# EAGLE design DCC Read Write Board (EAGLE 9.0.1)

## Sheet 1 of 2
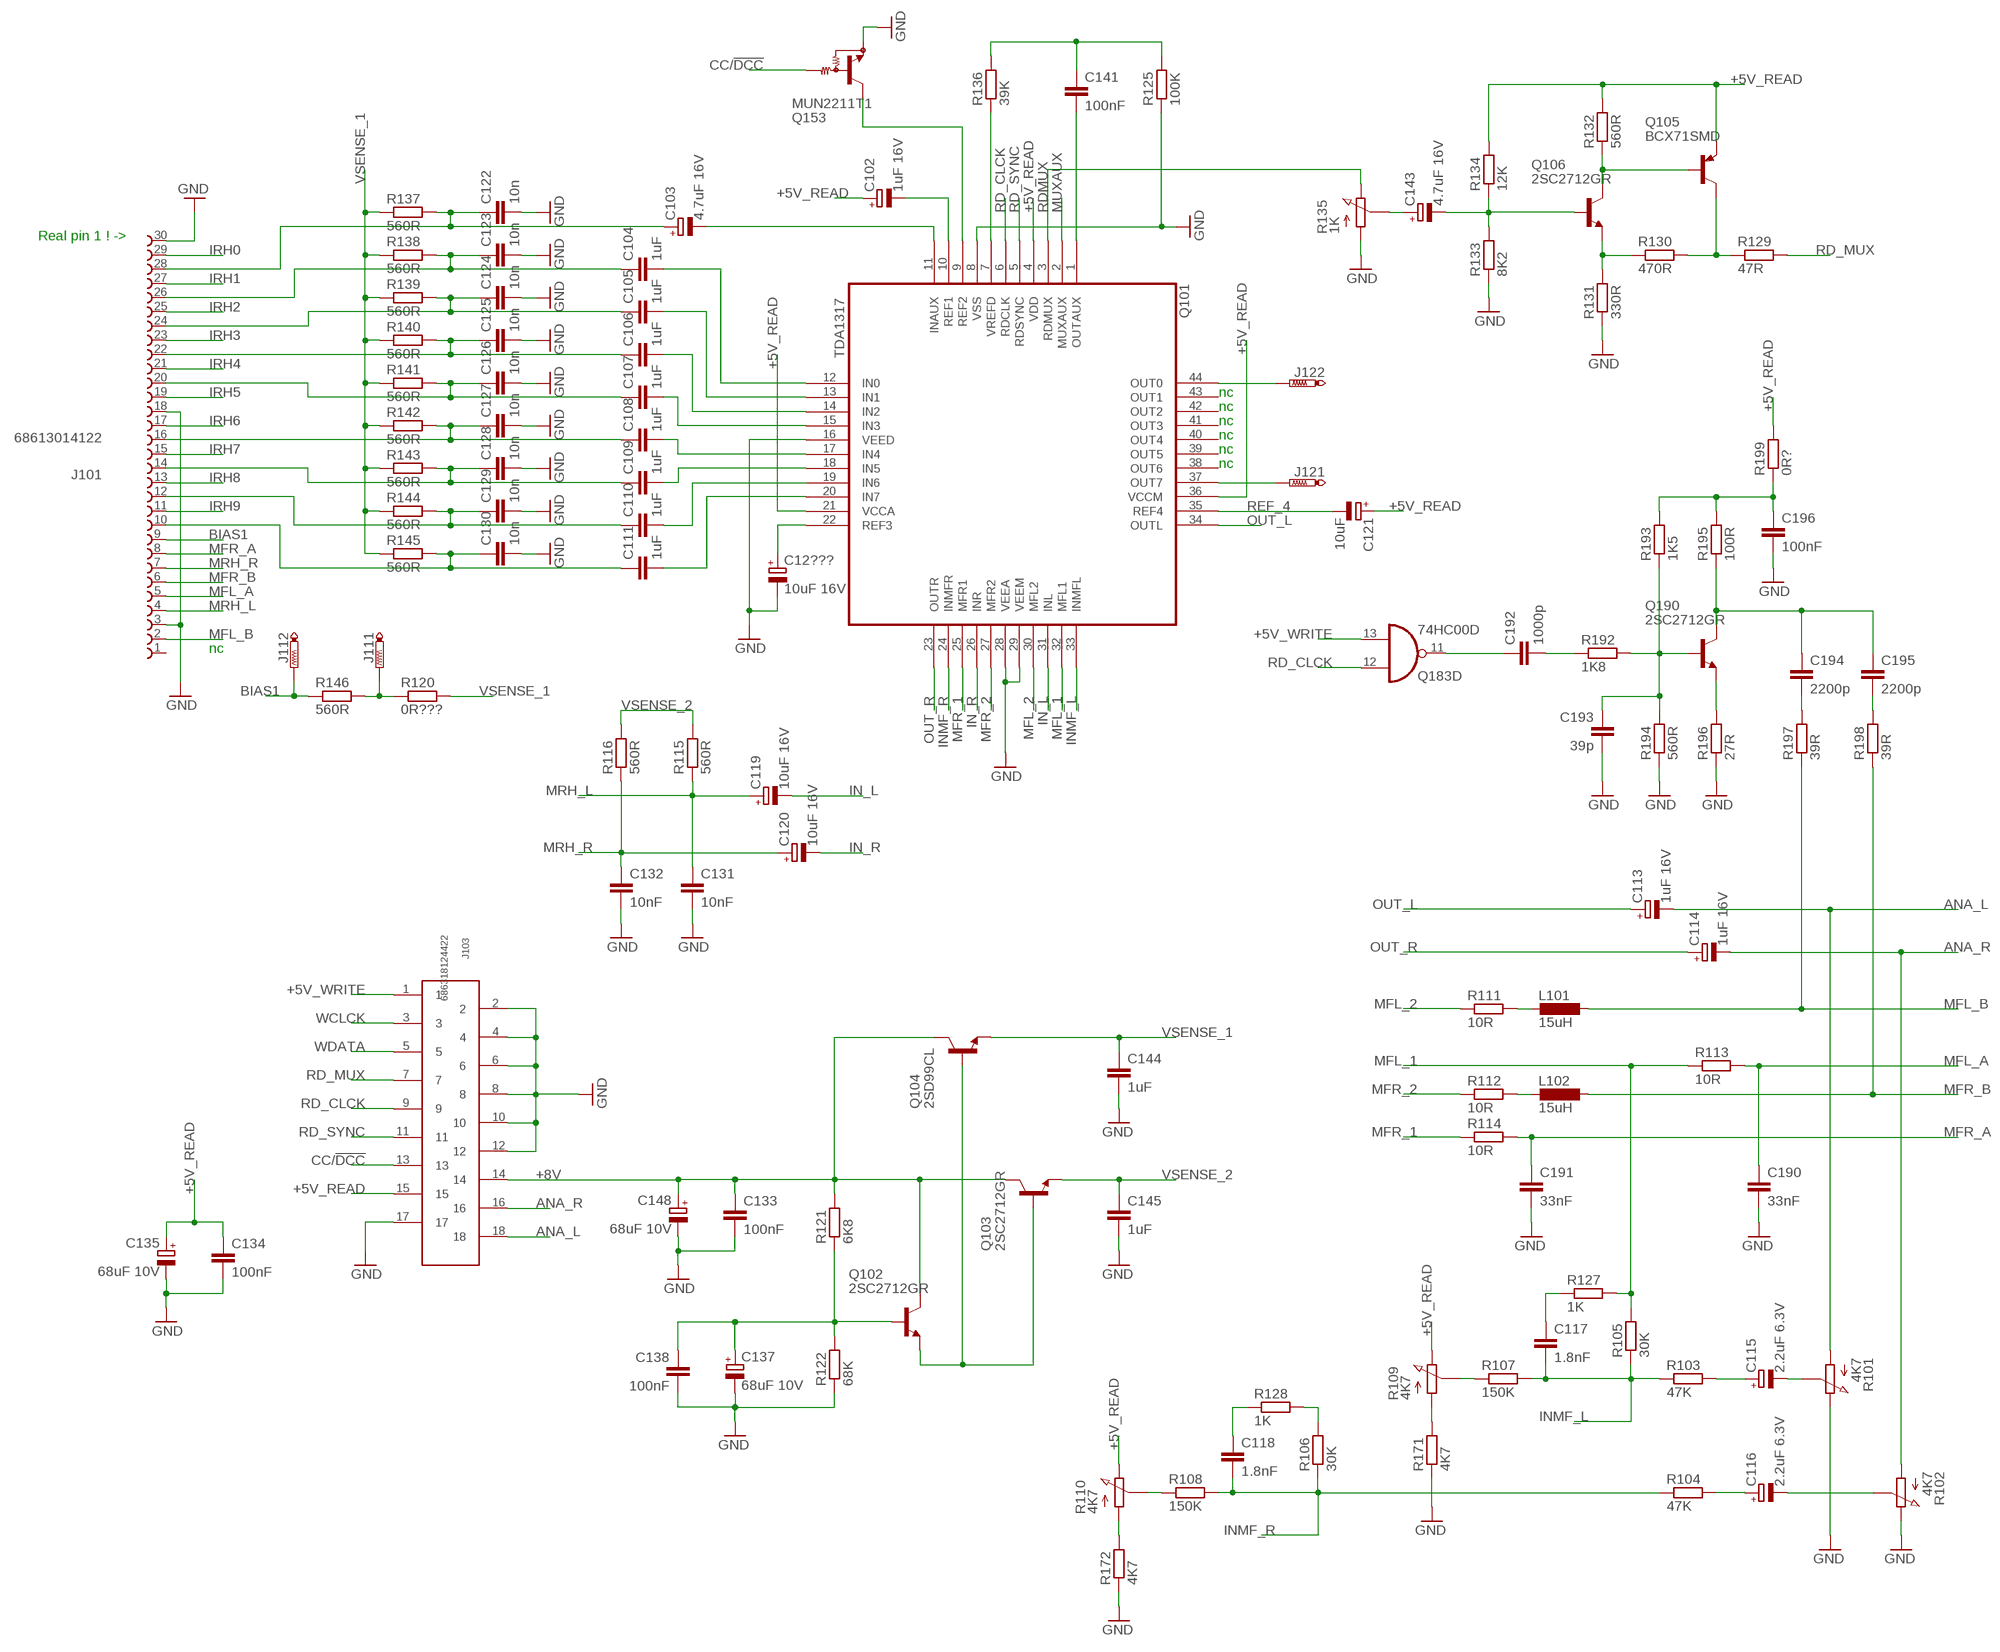
[diagram p0: schematic, sheet 1]

### Parts
C12???  10uF 16V  CPOL-EU153CLV-0505  [153CLV-0505]
C102  1uF 16V  CPOL-EUB/3528-21W  [B/3528-21W]
C103  4.7uF 16V  CPOL-EU153CLV-0505  [153CLV-0505]
C104  1uF  C-EUC0603  [C0603]
C105  1uF  C-EUC0603  [C0603]
C106  1uF  C-EUC0603  [C0603]
C107  1uF  C-EUC0603  [C0603]
C108  1uF  C-EUC0603  [C0603]
C109  1uF  C-EUC0603  [C0603]
C110  1uF  C-EUC0603  [C0603]
C111  1uF  C-EUC0603  [C0603]
C113  1uF 16V  CPOL-EUB/3528-21W  [B/3528-21W]
C114  1uF 16V  CPOL-EUB/3528-21W  [B/3528-21W]
C115  2.2uF 6.3V  CPOL-EUC/6032-28R  [C/6032-28R]
C116  2.2uF 6.3V  CPOL-EUC/6032-28R  [C/6032-28R]
C117  1.8nF  C-EUC0603  [C0603]
C118  1.8nF  C-EUC0603  [C0603]
C119  10uF 16V  CPOL-EU153CLV-0505  [153CLV-0505]
C120  10uF 16V  CPOL-EU153CLV-0505  [153CLV-0505]
C121  10uF  CPOL-EU153CLV-0505  [153CLV-0505]
C122  10n  C-EUC0603  [C0603]
C123  10n  C-EUC0603  [C0603]
C124  10n  C-EUC0603  [C0603]
C125  10n  C-EUC0603  [C0603]
C126  10n  C-EUC0603  [C0603]
C127  10n  C-EUC0603  [C0603]
C128  10n  C-EUC0603  [C0603]
C129  10n  C-EUC0603  [C0603]
C130  10n  C-EUC0603  [C0603]
C131  10nF  C-EUC0603  [C0603]
C132  10nF  C-EUC0603  [C0603]
C133  100nF  C-EUC0603  [C0603]
C134  100nF  C-EUC0603  [C0603]
C135  68uF 10V  CPOL-EUE  [PANASONIC_E]
C137  68uF 10V  CPOL-EUE  [PANASONIC_E]
C138  100nF  C-EUC0603  [C0603]
C141  100nF  C-EUC0603  [C0603]
C143  4.7uF 16V  CPOL-EU153CLV-0505  [153CLV-0505]
C144  1uF  C-EUC0603  [C0603]
C145  1uF  C-EUC0603  [C0603]
C148  68uF 10V  CPOL-EUE  [PANASONIC_E]
C190  33nF  C-EUC0603  [C0603]
C191  33nF  C-EUC0603  [C0603]
C192  1000p  C-EUC0603  [C0603]
C193  39p  C-EUC0603  [C0603]
C194  2200p  C-EUC0603  [C0603]
C195  2200p  C-EUC0603  [C0603]
C196  100nF  C-EUC0603  [C0603]
J101  68613014122  [68613014122]
J103  686318124422  [686318124422]
J111  PTR1TP18SQ  [TP18SQ]
J112  PTR1TP18SQ  [TP18SQ]
J121  PTR1TP18SQ  [TP18SQ]
J122  PTR1TP18SQ  [TP18SQ]
L101  15uH  L-EUL1812  [L1812]
L102  15uH  L-EUL1812  [L1812]
Q101  TDA1317  [QFP44]
Q102  2SC2712GR  BC849SMD  [SOT23-BEC]
Q103  2SC2712GR  BC849SMD  [SOT23-BEC]
Q104  2SD99CL  BC849SMD  [SOT23-BEC]
Q105  BCX71SMD  [SOT23]
Q106  2SC2712GR  BC849SMD  [SOT23-BEC]
Q153  MUN2211T1  [SC59-BEC]
Q183  74HC00D  [SO14]
Q190  2SC2712GR  BC849SMD  [SOT23-BEC]
R101  4K7  PC25  [PC25]
R102  4K7  PC25  [PC25]
R103  47K  R-EU_R0603  [R0603]
R104  47K  R-EU_R0603  [R0603]
R105  30K  R-EU_R0603  [R0603]
R106  30K  R-EU_R0603  [R0603]
R107  150K  R-EU_R0603  [R0603]
R108  150K  R-EU_R0603  [R0603]
R109  4K7  PC25  [PC25]
R110  4K7  PC25  [PC25]
R111  10R  R-EU_R0603  [R0603]
R112  10R  R-EU_R0603  [R0603]
R113  10R  R-EU_R0603  [R0603]
R114  10R  R-EU_R0603  [R0603]
R115  560R  R-EU_R0603  [R0603]
R116  560R  R-EU_R0603  [R0603]
R120  0R???  R-EU_R0603  [R0603]
R121  6K8  R-EU_R0603  [R0603]
R122  68K  R-EU_R0603  [R0603]
R125  100K  R-EU_R0603  [R0603]
R127  1K  R-EU_R0603  [R0603]
R128  1K  R-EU_R0603  [R0603]
R129  47R  R-EU_R0603  [R0603]
R130  470R  R-EU_R0603  [R0603]
R131  330R  R-EU_R0603  [R0603]
R132  560R  R-EU_R0603  [R0603]
R133  8K2  R-EU_R0603  [R0603]
R134  12K  R-EU_R0603  [R0603]
R135  1K  PC25  [PC25]
R136  39K  R-EU_R0603  [R0603]
R137  560R  R-EU_R0603  [R0603]
R138  560R  R-EU_R0603  [R0603]
R139  560R  R-EU_R0603  [R0603]
R140  560R  R-EU_R0603  [R0603]
R141  560R  R-EU_R0603  [R0603]
R142  560R  R-EU_R0603  [R0603]
R143  560R  R-EU_R0603  [R0603]
R144  560R  R-EU_R0603  [R0603]
R145  560R  R-EU_R0603  [R0603]
R146  560R  R-EU_R0603  [R0603]
R171  4K7  R-EU_R0603  [R0603]
R172  4K7  R-EU_R0603  [R0603]
R192  1K8  R-EU_R0603  [R0603]
R193  1K5  R-EU_R0603  [R0603]
R194  560R  R-EU_R0603  [R0603]
R195  100R  R-EU_R0603  [R0603]
R196  27R  R-EU_R0603  [R0603]
R197  39R  R-EU_R0603  [R0603]
R198  39R  R-EU_R0603  [R0603]
R199  0R?  R-EU_R0603  [R0603]

### Nets
+5V_READ: C102.+ C121.+ C134.1 C135.+ J103.15 Q101.4(VDD) Q101.21(VCCA) Q101.36(VCCM) Q105.2(E) R109.E R110.E R132.2 R134.2 R199.2
+5V_WRITE: J103.1 Q183.13(D:I1) ; also sheet 2
+8V: C133.1 C148.+ J103.14 Q102.C Q103.C Q104.C R121.2
ANA_L: C113.- J103.18 R101.A
ANA_R: C114.- J103.16 R102.A
BIAS1: J101.9 J112.TP R146.1
CC/!DCC: J103.13 Q153.B
GND: C12???.- C122.2 C123.2 C124.2 C125.2 C126.2 C127.2 C128.2 C129.2 C130.2 C131.2 C132.2 C133.2 C134.2 C135.- C137.- C138.2 C144.2 C145.2 C148.- C190.2 C191.2 C193.2 C196.2 J101.3 J101.18 J101.30 J103.2 J103.4 J103.6 J103.8 J103.10 J103.12 J103.17 Q101.8(VSS) Q101.16(VEED) Q101.28(VEEA) Q101.29(VEEM) Q153.E R101.E R102.E R122.1 R125.1 R131.1 R133.1 R135.A R171.1 R172.1 R194.1 R196.1 ; also sheet 2
IN_L: C119.- Q101.31(INL)
IN_R: C120.- Q101.26(INR)
INMF_L: C117.2 Q101.33(INMFL) R103.1 R105.1 R107.2
INMF_R: C118.2 Q101.24(INMFR) R104.1 R106.1 R108.2
IRH0: J101.29 ; also sheet 2
IRH1: J101.27 ; also sheet 2
IRH2: J101.25 ; also sheet 2
IRH3: J101.23 ; also sheet 2
IRH4: J101.21 ; also sheet 2
IRH5: J101.19 ; also sheet 2
IRH6: J101.17 ; also sheet 2
IRH7: J101.15 ; also sheet 2
IRH8: J101.13 ; also sheet 2
IRH9: J101.11 ; also sheet 2
MFL_1: Q101.32(MFL1) R105.2 R113.1 R127.2
MFL_2: Q101.30(MFL2) R111.1
MFL_3: R106.2 R128.2
MFL_A: C190.1 J101.5 R113.2
MFL_B: J101.2 L101.1 R197.1
MFR_1: Q101.25(MFR1) R114.1
MFR_2: Q101.27(MFR2) R112.1
MFR_A: C191.1 J101.8 R114.2
MFR_B: J101.6 L102.1 R198.1
MRH_L: C119.+ C131.1 J101.4 R115.1
MRH_R: C120.+ C132.1 J101.7 R116.1
MUXAUX: Q101.2(MUXAUX)
N$1: C111.2 Q101.20(IN7)
N$2: C110.2 Q101.19(IN6)
N$3: C109.2 Q101.18(IN5)
N$4: C108.2 Q101.17(IN4)
N$5: C107.2 Q101.15(IN3)
N$6: C106.2 Q101.14(IN2)
N$7: C105.2 Q101.13(IN1)
N$8: C104.2 Q101.12(IN0)
N$9: C103.- Q101.11(INAUX)
N$19: C111.1 C130.1 J101.10 R145.2
N$20: C110.1 C129.1 J101.12 R144.2
N$21: C109.1 C128.1 J101.14 R143.2
N$22: C108.1 C127.1 J101.16 R142.2
N$23: C107.1 C126.1 J101.20 R141.2
N$24: C106.1 C125.1 J101.22 R140.2
N$25: C105.1 C124.1 J101.24 R139.2
N$26: C104.1 C123.1 J101.26 R138.2
N$27: C103.+ C122.1 J101.28 R137.2
N$44: Q101.9(REF2) Q153.C
N$51: Q102.E Q103.B Q104.B
N$52: C137.+ C138.1 Q102.B R121.1 R122.2
N$53: C102.- Q101.10(REF1)
N$54: C141.2 Q101.1(OUTAUX)
N$55: Q101.7(VREFD) R136.1
N$56: C141.1 R125.2 R136.2
N$57: C12???.+ Q101.22(REF3)
N$58: C192.1 Q183.11(D:O)
N$59: C192.2 R192.1
N$60: C196.1 R193.2 R195.2 R199.1
N$61: C193.1 Q190.B R192.2 R193.1 R194.2
N$62: C194.1 C195.1 Q190.C R195.1
N$63: Q190.E R196.2
N$64: C195.2 R198.2
N$65: C194.2 R197.2
N$66: L102.2 R112.2
N$67: L101.2 R111.2
N$68: J122.TP Q101.44(OUT0)
N$69: J121.TP Q101.37(OUT7)
N$70: J111.TP R120.1 R146.2
N$71: C115.- R101.S
N$72: C116.- R102.S
N$73: C115.+ R103.2
N$74: C116.+ R104.2
N$75: C143.- Q106.B R133.2 R134.1
N$76: C117.1 R127.1
N$77: R107.1 R109.S
N$78: Q106.E R130.1 R131.2
N$79: C118.1 R128.1
N$80: R108.1 R110.S
N$81: R109.A R171.2
N$82: R110.A R172.2
N$83: Q105.1(B) Q106.C R132.1
N$84: Q105.3(C) R129.1 R130.2
N$85: C143.+ R135.S
OUT_L: C113.+ Q101.34(OUTL)
OUT_R: C114.+ Q101.23(OUTR)
RD_CLCK: J103.9 Q101.6(RDCLK) Q183.12(D:I0)
RD_MUX: J103.7 R129.2
RD_SYNC: J103.11 Q101.5(RDSYNC)
RDMUX: Q101.3(RDMUX) R135.E
REF_4: C121.- Q101.35(REF4)
VSENSE_1: C144.1 Q104.E R120.2 R137.1 R138.1 R139.1 R140.1 R141.1 R142.1 R143.1 R144.1 R145.1
VSENSE_2: C145.1 Q103.E R115.2 R116.2
WCLCK: J103.3 ; also sheet 2
WDATA: J103.5 ; also sheet 2
Unconnected: J101.1 Q101.38(OUT6) Q101.39(OUT5) Q101.40(OUT4) Q101.41(OUT3) Q101.42(OUT2) Q101.43(OUT1)

### Notes on the sheet
- Real pin 1 ! ->
- nc
- nc
- nc
- nc
- nc
- nc
- nc

## Sheet 2 of 2
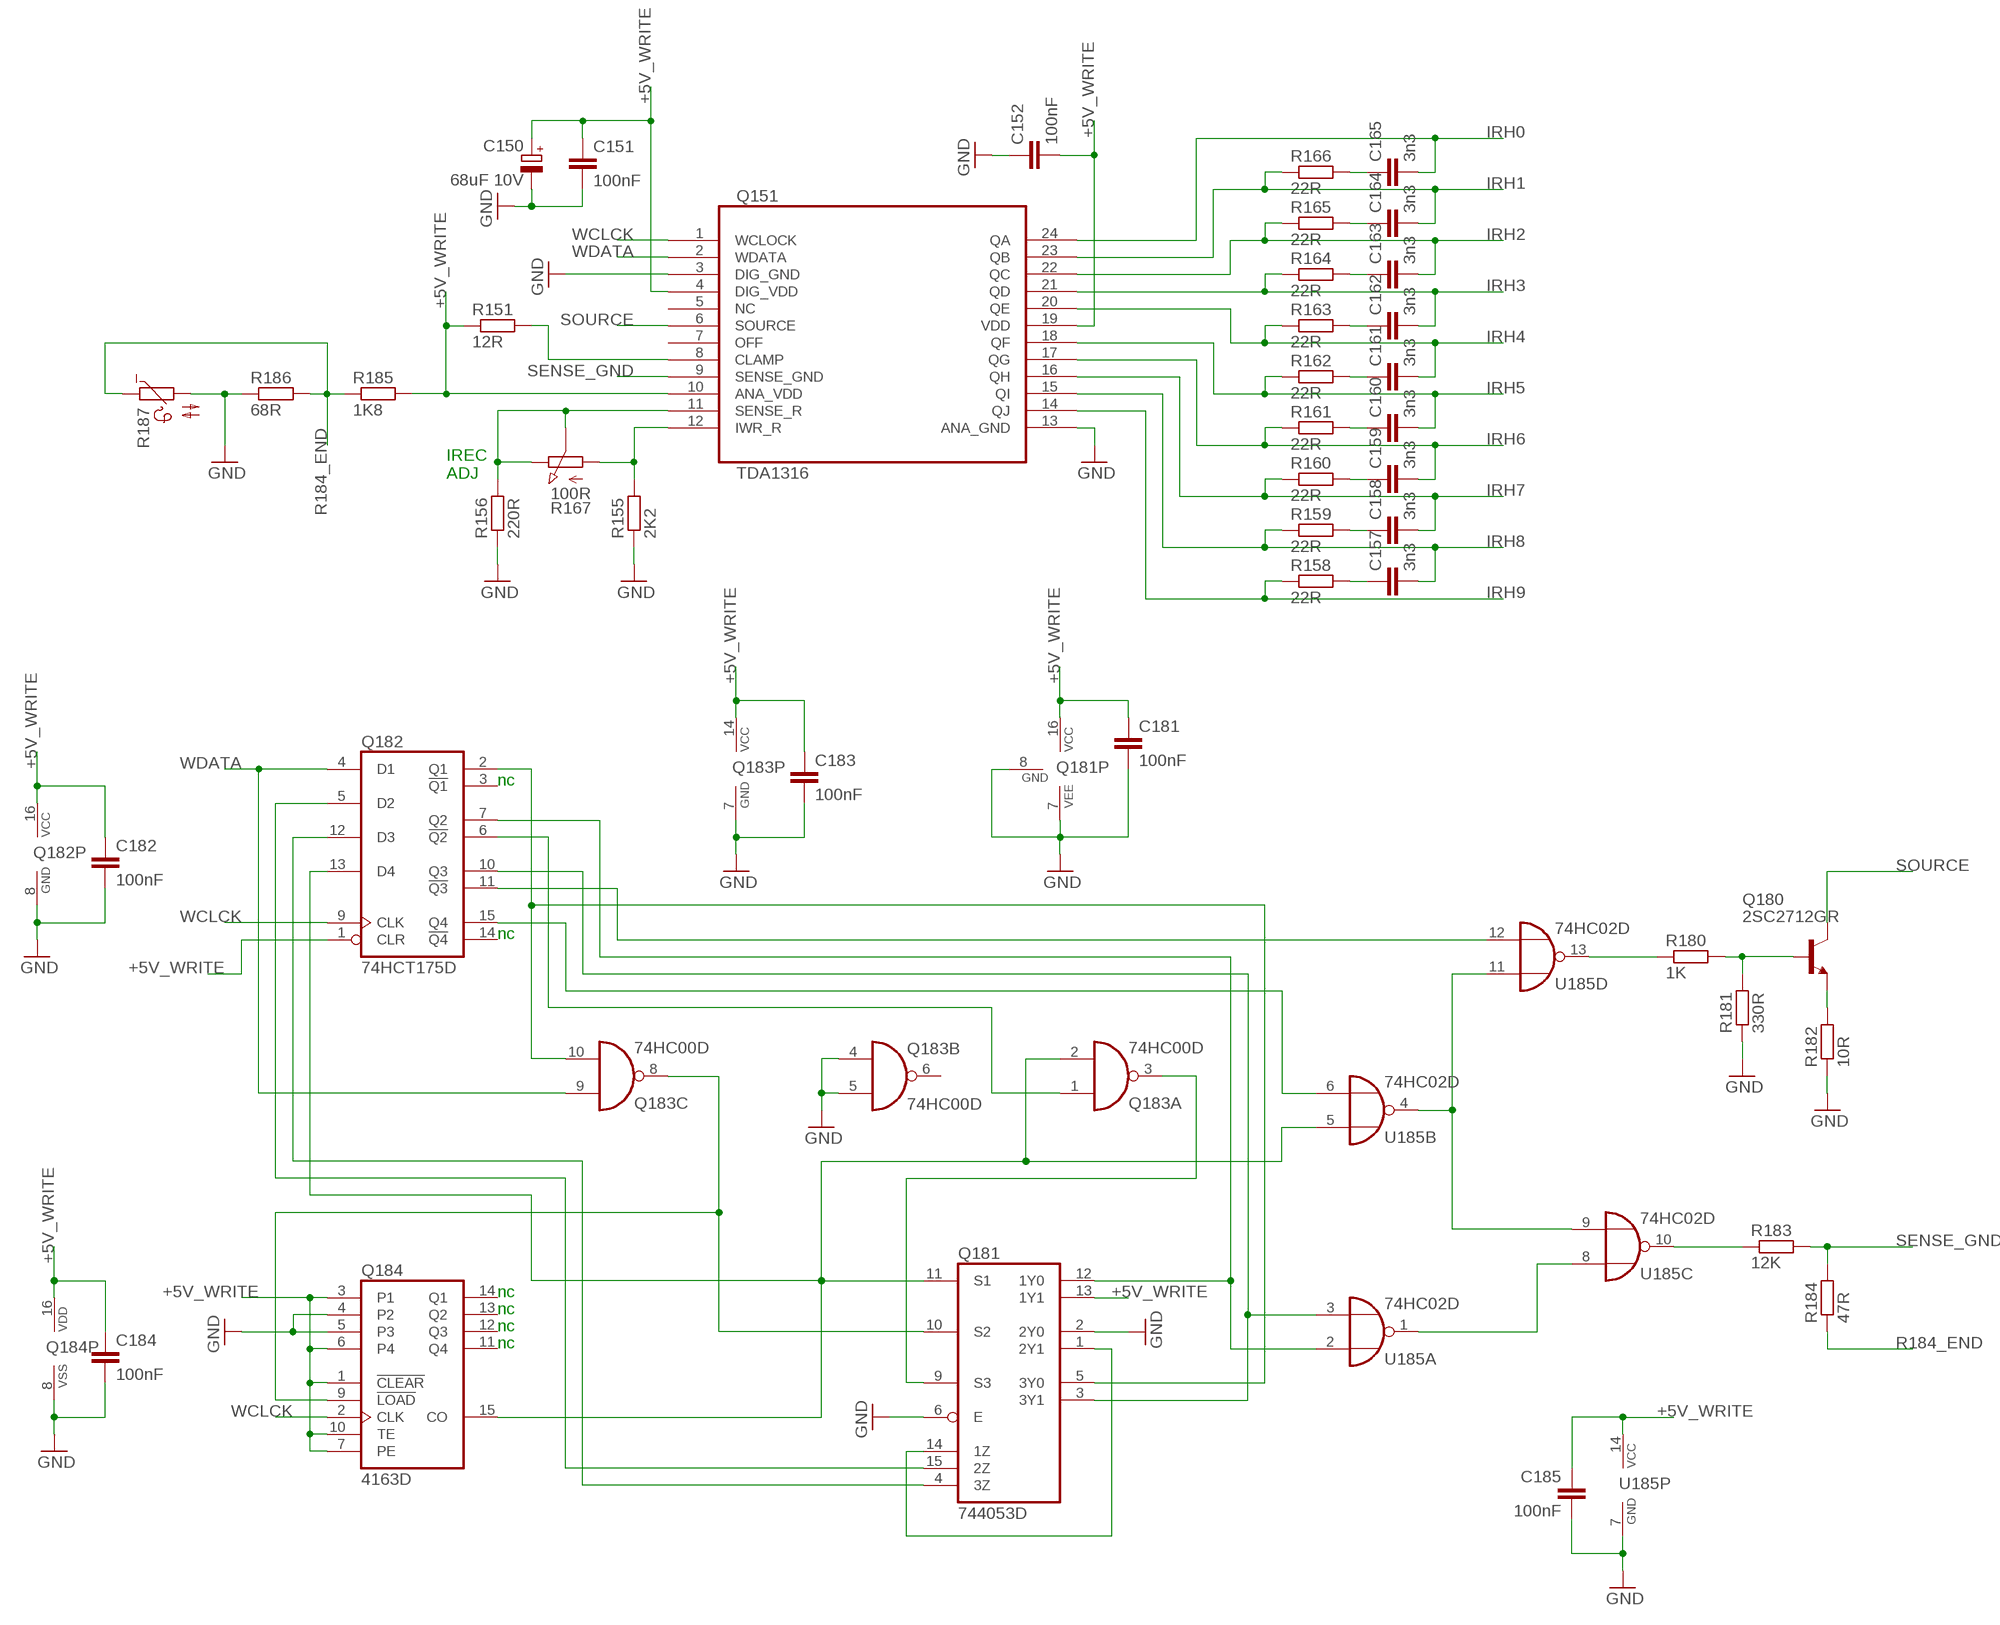
[diagram p1: schematic, sheet 2]

### Parts
C150  68uF 10V  CPOL-EUE  [PANASONIC_E]
C151  100nF  C-EUC0603  [C0603]
C152  100nF  C-EUC0603  [C0603]
C157  3n3  C-EUC0603  [C0603]
C158  3n3  C-EUC0603  [C0603]
C159  3n3  C-EUC0603  [C0603]
C160  3n3  C-EUC0603  [C0603]
C161  3n3  C-EUC0603  [C0603]
C162  3n3  C-EUC0603  [C0603]
C163  3n3  C-EUC0603  [C0603]
C164  3n3  C-EUC0603  [C0603]
C165  3n3  C-EUC0603  [C0603]
C181  100nF  C-EUC0603  [C0603]
C182  100nF  C-EUC0603  [C0603]
C183  100nF  C-EUC0603  [C0603]
C184  100nF  C-EUC0603  [C0603]
C185  100nF  C-EUC0603  [C0603]
Q151  TDA1316  [SO24L]
Q180  2SC2712GR  BC849SMD  [SOT23-BEC]
Q181  744053D  [SO16]
Q182  74HCT175D  [SO16]
Q184  4163D  [SO16]
R151  12R  R-EU_R0603  [R0603]
R155  2K2  R-EU_R0603  [R0603]
R156  220R  R-EU_R0603  [R0603]
R158  22R  R-EU_R0603  [R0603]
R159  22R  R-EU_R0603  [R0603]
R160  22R  R-EU_R0603  [R0603]
R161  22R  R-EU_R0603  [R0603]
R162  22R  R-EU_R0603  [R0603]
R163  22R  R-EU_R0603  [R0603]
R164  22R  R-EU_R0603  [R0603]
R165  22R  R-EU_R0603  [R0603]
R166  22R  R-EU_R0603  [R0603]
R167  100R  PC25  [PC25]
R180  1K  R-EU_R0603  [R0603]
R181  330R  R-EU_R0603  [R0603]
R182  10R  R-EU_R0603  [R0603]
R183  12K  R-EU_R0603  [R0603]
R184  47R  R-EU_R0603  [R0603]
R185  1K8  R-EU_R0603  [R0603]
R186  68R  R-EU_R0603  [R0603]
R187  B57164  [B57164]
U185  74HC02D  [SO14]

### Nets
+5V_WRITE: C150.+ C151.1 C152.2 C181.1 C182.1 C183.1 C184.1 C185.1 Q151.4(DIG_VDD) Q151.10(ANA_VDD) Q151.19(VDD) Q181.13(1Y1) Q181.16(VCC) Q182.1(CLR) Q182.16(VCC) Q183.14(P:VCC) Q184.1(!CLEAR) Q184.3(P1) Q184.6(P4) Q184.7(PE) Q184.10(TE) Q184.16(VDD) R151.1 R185.2 U185.14(P:VCC) ; also sheet 1
GND: C150.- C151.2 C152.1 C181.2 C182.2 C183.2 C184.2 C185.2 Q151.3(DIG_GND) Q151.13(ANA_GND) Q181.2(2Y0) Q181.6(E) Q181.7(VEE) Q181.8(GND) Q182.8(GND) Q183.4(B:I0) Q183.5(B:I1) Q183.7(P:GND) Q184.4(P2) Q184.5(P3) Q184.8(VSS) R155.1 R156.1 R181.1 R182.1 R186.1 R187.2 U185.7(P:GND) ; also sheet 1
IRH0: C165.2 Q151.24(QA) ; also sheet 1
IRH1: C164.2 Q151.23(QB) R166.1 ; also sheet 1
IRH2: C163.2 Q151.22(QC) R165.1 ; also sheet 1
IRH3: C162.2 Q151.21(QD) R164.1 ; also sheet 1
IRH4: C161.2 Q151.20(QE) R163.1 ; also sheet 1
IRH5: C160.2 Q151.18(QF) R162.1 ; also sheet 1
IRH6: C159.2 Q151.17(QG) R161.1 ; also sheet 1
IRH7: C158.2 Q151.16(QH) R160.1 ; also sheet 1
IRH8: C157.2 Q151.15(QI) R159.1 ; also sheet 1
IRH9: Q151.14(QJ) R158.1 ; also sheet 1
N$11: Q181.10(S2) Q183.8(C:O) Q184.9(!LOAD)
N$12: Q181.5(3Y0) Q182.2(Q1) Q183.10(C:I1)
N$13: Q181.11(S1) Q182.13(D4) Q183.2(A:I1) Q184.15(CO) U185.5(B:I0)
N$14: Q181.15(2Z) Q182.5(D2)
N$15: Q181.9(S3) Q183.3(A:O)
N$16: Q182.6(!Q2) Q183.1(A:I0)
N$17: Q182.15(Q4) U185.6(B:I1)
N$18: U185.4(B:O) U185.9(C:I1) U185.11(D:I0)
N$28: Q181.3(3Y1) Q182.10(Q3) U185.3(A:I1)
N$29: Q181.1(2Y1) Q181.14(1Z)
N$30: C165.1 R166.2
N$31: C164.1 R165.2
N$32: C163.1 R164.2
N$33: C162.1 R163.2
N$34: C161.1 R162.2
N$35: C160.1 R161.2
N$36: C159.1 R160.2
N$37: C158.1 R159.2
N$38: C157.1 R158.2
N$39: Q181.12(1Y0) Q182.7(Q2) U185.2(A:I0)
N$40: U185.1(A:O) U185.8(C:I0)
N$41: Q182.11(!Q3) U185.12(D:I1)
N$42: Q181.4(3Z) Q182.12(D3)
N$43: R183.1 U185.10(C:O)
N$45: R180.1 U185.13(D:O)
N$46: Q180.B R180.2 R181.2
N$47: Q180.E R182.2
N$48: Q151.11(SENSE_R) R156.2 R167.E R167.S
N$49: Q151.12(IWR_R) R155.2 R167.A
N$50: Q151.8(CLAMP) R151.2
R184_END: R184.1 R185.1 R186.2 R187.1
SENSE_GND: Q151.9(SENSE_GND) R183.2 R184.2
SOURCE: Q151.6(SOURCE) Q180.C
WCLCK: Q151.1(WCLOCK) Q182.9(CLK) Q184.2(CLK) ; also sheet 1
WDATA: Q151.2(WDATA) Q182.4(D1) Q183.9(C:I0) ; also sheet 1
Unconnected: Q151.5(NC) Q151.7(OFF) Q182.3(!Q1) Q182.14(!Q4) Q183.6(B:O) Q184.11(Q4) Q184.12(Q3) Q184.13(Q2) Q184.14(Q1)

### Notes on the sheet
- IREC
  ADJ
- nc
- nc
- nc
- nc
- nc
- nc

## Library data of the parts
C12??? C102 C103 C113-C116 C119-C121 C135 C137 C143 C148 C150 = rcl:CPOL-EU: POLARIZED CAPACITOR, European symbol; SPICEPREFIX: C
C104-C111 C117 C118 C122-C134 C138 C141 C144 C145 C151 C152 C157-C165 C181-C185 C190-C196 = rcl:C-EU: CAPACITOR, European symbol; SPICEPREFIX: C
J101 = FPC_Connectors_Flat_Flexible_Cable_rev15c:68613014122: WR-FPC 1.00mm SMT ZIF Horizontal Top Contact, 30 Pins=>Code : Con_FPC_ZIF_1.00_68613014122 <http://katalog.we-online.de/media/images/eican/Con_FPC_ZIF_1.00_6861xx14122_pf2.jpg> Details see: http://katalog.we-online.de/en/em/686_1xx_141_22 Created 2014-07-09, Karrer Zheng 2014 (C) Würth Elektronik
J103 = FPC_Connectors_Flat_Flexible_Cable_rev15c:686318124422: WR-FPC-1.00mm SMT ZIF Vertical Type A,18 pins=>Code : Con_FPC_ZIF_1.00_686318124422 <http://katalog.we-online.de/media/images/eican/Con_FPC_ZIF_1.00_6863xx124422_pf2.jpg> Details see: http://katalog.we-online.de/en/em/686_3xx_124_422 Created 2014-07-09, Karrer Zheng 2014 (C) Würth Elektronik
J111 J112 J121 J122 = testpad:PTR1: TEST PIN
L101 L102 = rcl:L-EU: INDUCTOR, European symbol; SPICEPREFIX: L
Q101 = dcc:TDA1317
Q102-Q104 Q106 Q180 Q190 = transistor-npn:BC849*: NPN Transistor
Q105 = transistor-pnp:BCX71SMD: PNP Transistor
Q151 = dcc:TDA1316
Q153 = transistor-npn:MUN2211*: NPN Bias Resistor Transistor
Q181 = 74xx-eu:74*4053: Triple 2-channel analog multiplexer/demultiplexer Philips Semiconductor
Q182 = 74xx-eu:74*175: Qadruple D type FLIP FLOP, clear
Q183 = 74xx-eu:74*00: Quad 2-input NAND gate
Q184 = 40xx:4163: Synchronous presettable 4-bit binary COUNTER
R101 R102 R109 R110 R135 R167 = pot-vitrohm:PC25: VITROHM POTENTIOMETER; MF: CLAROSTAT; MPN: 308NPC25KS; OC_FARNELL: 1440998; OC_NEWARK: 03F7518
R103-R108 R111-R116 R120-R122 R125 R127-R134 R136-R146 R151 R155 R156 R158-R166 R171 R172 R180-R186 R192-R199 = rcl:R-EU_: RESISTOR, European symbol; SPICEPREFIX: R
R187 = ptc-ntc:B57164: SIEMENS NTC; MPN: B57164K474K52; OC_FARNELL: 9753451; OC_NEWARK: 29M3118
U185 = 74xx-eu:74*02: Quad 2-input NOR gate

## Board
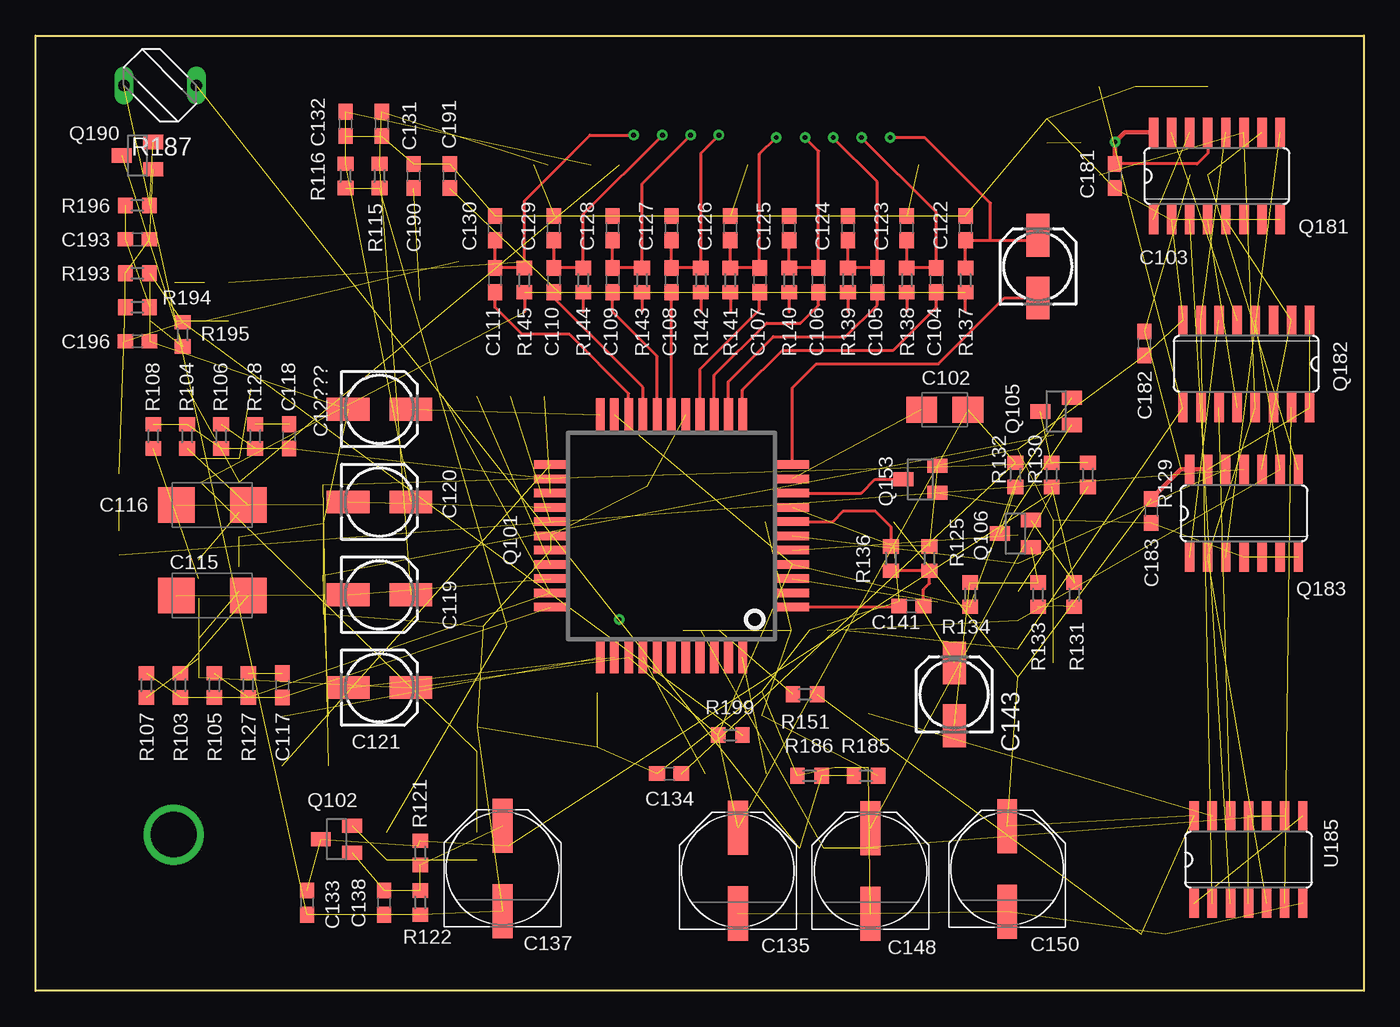
[diagram p2: board, top side]
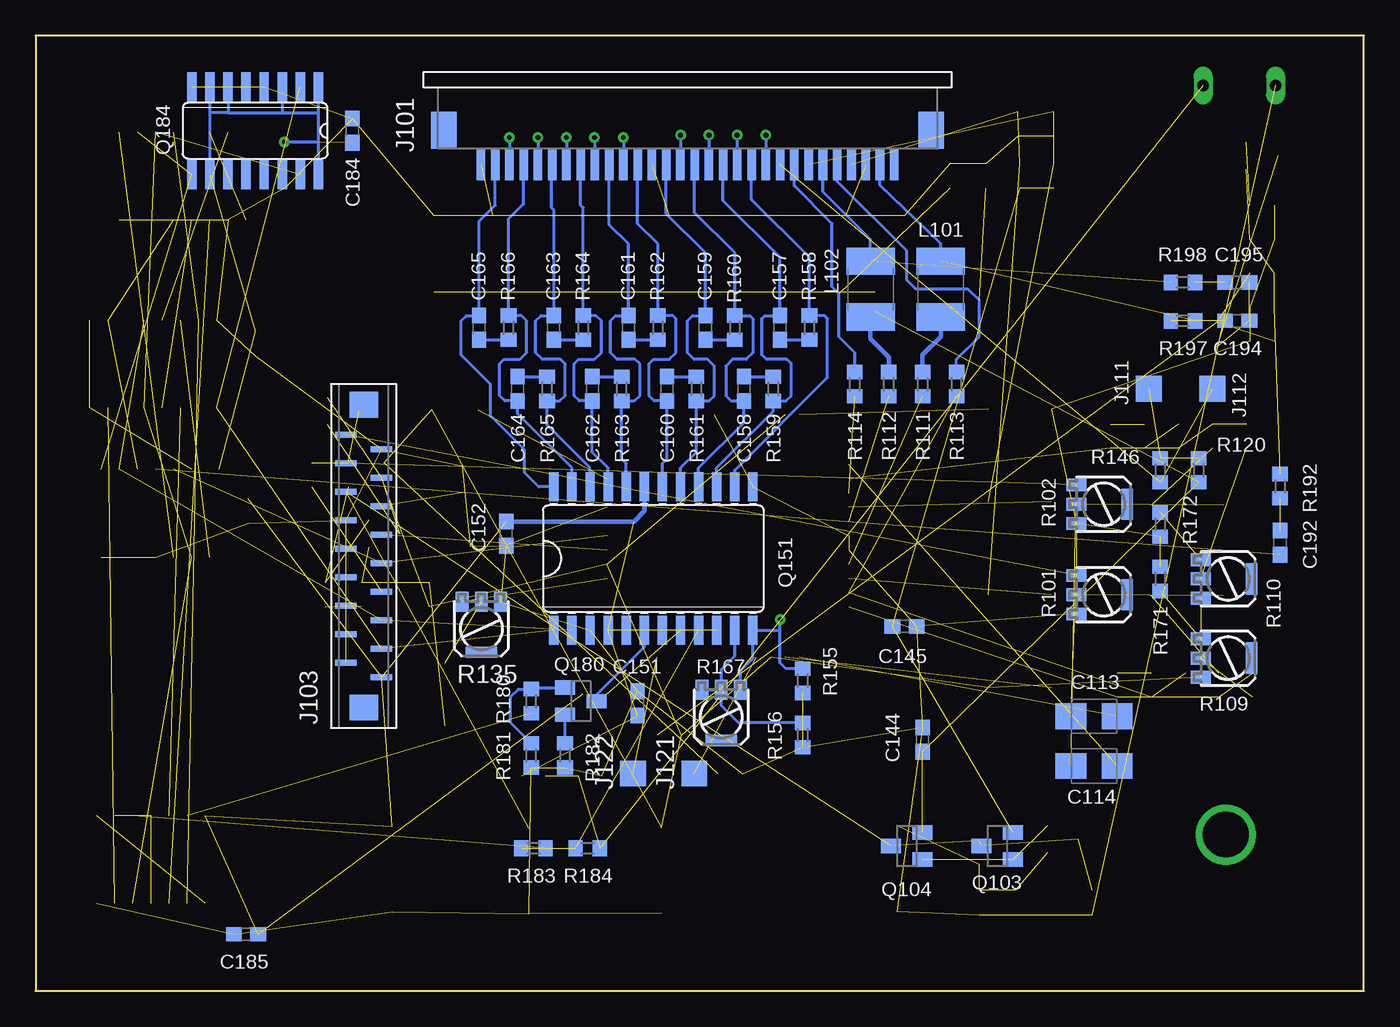
[diagram p3: board, bottom side, seen from below]

Size 93.19 x 66.99 mm. Coordinates in mm from the lower left corner, seen from the top.
Outline: 0,0 0,66.99 93.19,66.99 93.19,0 0,0
Copper layers (1*16): Top 0.035mm / dielectric 1.5mm / Bottom 0.035mm
Design rules "default *": minimum track width 6mil, minimum drill 13mil, track to track 6mil, track to pad 6mil, pad to pad 6mil, via to via 6mil, smd to smd 6mil, copper to edge 40mil, drill to drill 6mil, minimum pad ring 10mil, minimum via ring 8mil, stop-mask expansion 4mil, vias tented up to drill 0mil, thermal gap 10mil

### Footprints (pad centres in the part's own frame; a part is rotated, then mirrored left to right if it is on the bottom)
153CLV-0505 = smd 3 x 1.6: + 2.2,0; - -2.2,0
B/3528-21W = smd 2.15 x 1.8: + 1.625,0; - -1.625,0
C0603 = smd 1.1 x 1: 1 -0.85,0; 2 0.85,0
C/6032-28R = smd 2.55 x 2.5: + 2.525,0; - -2.525,0
PANASONIC_E = smd 3.8 x 1.4: + 3,0; - -3,0
68613014122 = smd 0.6 x 2.2: 1 -14.04,1.1; 2 -13.04,1.1; 3 -12.04,1.1; 4 -11.04,1.1; 5 -10.04,1.1; 6 -9.04,1.1; 7 -8.04,1.1; 8 -7.04,1.1; 9 -6.04,1.1; 10 -5.04,1.1; 11 -4.04,1.1; 12 -3.04,1.1; 13 -2.04,1.1; 14 -1.04,1.1; 15 -0.04,1.1; 16 0.96,1.1; 17 1.96,1.1; 18 2.96,1.1; 19 3.96,1.1; 20 4.96,1.1; 21 5.96,1.1; 22 6.96,1.1; 23 7.96,1.1; 24 8.96,1.1; 25 9.96,1.1; 26 10.96,1.1; 27 11.96,1.1; 28 12.96,1.1; 29 13.96,1.1; 30 14.96,1.1 | smd 1.8 x 2.6: Z1 -16.64,-1.3; Z2 17.56,-1.3
686318124422 = smd 0.42 x 1.5: 1 -7.85,-1.25; 2 -6.85,1.25; 3 -5.85,-1.25; 4 -4.85,1.25; 5 -3.85,-1.25; 6 -2.85,1.25; 7 -1.85,-1.25; 8 -0.85,1.25; 9 0.15,-1.25; 10 1.15,1.25; 11 2.15,-1.25; 12 3.15,1.25; 13 4.15,-1.25; 14 5.15,1.25; 15 6.15,-1.25; 16 7.15,1.25; 17 8.15,-1.25; 18 9.15,1.25 | smd 1.8 x 2: Z1 -9.96,0; Z2 11.26,0
TP18SQ = smd 1.8 x 1.8: TP 0,0
L1812 = smd 1.9 x 3.4: 1 -1.95,0; 2 1.95,0
QFP44 = smd 0.6 x 2.3: 1 -5,-8.5; 2 -4,-8.5; 3 -3,-8.5; 4 -2,-8.5; 5 -1,-8.5; 6 0,-8.5; 7 1,-8.5; 8 2,-8.5; 9 3,-8.5; 10 4,-8.5; 11 5,-8.5; 23 5,8.5; 24 4,8.5; 25 3,8.5; 26 2,8.5; 27 1,8.5; 28 0,8.5; 29 -1,8.5; 30 -2,8.5; 31 -3,8.5; 32 -4,8.5; 33 -5,8.5 | smd 2.3 x 0.6: 12 8.5,-5; 13 8.5,-4; 14 8.5,-3; 15 8.5,-2; 16 8.5,-1; 17 8.5,0; 18 8.5,1; 19 8.5,2; 20 8.5,3; 21 8.5,4; 22 8.5,5; 34 -8.5,5; 35 -8.5,4; 36 -8.5,3; 37 -8.5,2; 38 -8.5,1; 39 -8.5,0; 40 -8.5,-1; 41 -8.5,-2; 42 -8.5,-3; 43 -8.5,-4; 44 -8.5,-5
SOT23-BEC = smd 1 x 1.4: B -0.95,-1.1; C 0,1.1; E 0.95,-1.1
SOT23 = smd 1 x 1.4: 1 -0.95,-1.1; 2 0.95,-1.1; 3 0,1.1
SO24L = smd 0.66 x 2.032: 1 -8.255,-5.029; 2 -6.985,-5.029; 3 -5.715,-5.029; 4 -4.445,-5.029; 5 -3.175,-5.029; 6 -1.905,-5.029; 7 -0.635,-5.029; 8 0.635,-5.029; 9 1.905,-5.029; 10 3.175,-5.029; 11 4.445,-5.029; 12 5.715,-5.029; 13 5.715,5.029; 14 4.445,5.029; 15 3.175,5.029; 16 1.905,5.029; 17 0.635,5.029; 18 -0.635,5.029; 19 -1.905,5.029; 20 -3.175,5.029; 21 -4.445,5.029; 22 -5.715,5.029; 23 -6.985,5.029; 24 -8.255,5.029
SC59-BEC = smd 1 x 1.4: B -0.95,-1.2; C 0,1.2; E 0.95,-1.2
SO16 = smd 0.66 x 2.032: 1 -4.445,-3.073; 2 -3.175,-3.073; 3 -1.905,-3.073; 4 -0.635,-3.073; 5 0.635,-3.073; 6 1.905,-3.073; 7 3.175,-3.073; 8 4.445,-3.073; 9 4.445,3.073; 10 3.175,3.073; 11 1.905,3.073; 12 0.635,3.073; 13 -0.635,3.073; 14 -1.905,3.073; 15 -3.175,3.073; 16 -4.445,3.073
SO14 = smd 0.66 x 2.032: 1 -3.81,-3.073; 2 -2.54,-3.073; 3 -1.27,-3.073; 4 0,-3.073; 5 1.27,-3.073; 6 2.54,-3.073; 7 3.81,-3.073; 8 3.81,3.073; 9 2.54,3.073; 10 1.27,3.073; 11 0,3.073; 12 -1.27,3.073; 13 -2.54,3.073; 14 -3.81,3.073
PC25 = smd 2.2 x 0.8: 4 0,1.65 | smd 0.9 x 1.4: A -1.35,-1.9; E 1.35,-1.9; S 0,-1.9
R0603 = smd 1 x 1.1: 1 -0.85,0; 2 0.85,0
B57164 = drill 0.813 long: 1 -2.54,0; 2 2.54,0

### Placement (x,y rotation side)
C12???  24.13,40.8 0 top
C102  63.78,40.76 0 top
C103  70.33,50.8 90 top
C104  63.18,49.85 270 top
C105  59.05,49.85 270 top
C106  54.93,49.85 270 top
C107  50.8,49.85 270 top
C108  44.61,49.85 270 top
C109  40.48,49.85 270 top
C110  36.35,49.85 270 top
C111  32.23,49.85 270 top
C113  18.93,19.27 0 bottom
C114  18.93,15.77 0 bottom
C115  12.4,27.73 0 top
C116  12.4,34.08 0 top
C117  17.3,21.43 270 top
C118  17.78,38.89 270 top
C119  24.13,27.78 0 top
C120  24.13,34.29 0 top
C121  24.13,21.27 0 top
C122  65.25,53.5 90 top
C123  61.12,53.5 90 top
C124  56.99,53.5 90 top
C125  52.86,53.5 90 top
C126  48.74,53.5 90 top
C127  44.61,53.5 90 top
C128  40.48,53.5 90 top
C129  36.35,53.5 90 top
C130  32.23,53.5 90 top
C131  24.29,60.8 270 top
C132  21.75,60.8 270 top
C133  19.05,6.19 270 top
C134  44.45,15.24 180 top
C135  49.27,8.43 90 top
C137  32.76,8.59 90 top
C138  24.45,6.19 270 top
C141  61.44,26.99 180 top
C143  64.45,20.8 90 top
C144  30.96,17.62 90 bottom
C145  32.23,25.56 0 bottom
C148  58.58,8.41 90 top
C150  68.16,8.55 90 top
C151  50.96,20.16 90 bottom
C152  60.17,32.07 90 bottom
C157  40.96,46.51 90 bottom
C158  43.5,42.23 270 bottom
C159  46.2,46.51 90 bottom
C160  48.89,42.23 270 bottom
C161  51.59,46.51 90 bottom
C162  54.13,42.23 270 bottom
C163  56.83,46.51 90 bottom
C164  59.37,42.23 270 bottom
C165  62.07,46.51 90 bottom
C181  75.72,57.15 270 top
C182  77.79,45.4 270 top
C183  78.26,33.66 270 top
C184  70.96,60.33 90 bottom
C185  78.42,3.97 180 bottom
C190  26.51,57.15 90 top
C191  29.05,57.15 90 top
C192  5.87,31.43 90 bottom
C193  7.14,52.7 180 top
C194  8.89,46.99 180 bottom
C195  8.89,49.69 180 bottom
C196  7.14,45.56 0 top
J101  46.99,59.05 180 bottom
J103  70.17,29.84 90 bottom
J111  15.08,42.23 90 bottom
J112  10.64,42.23 270 bottom
J121  46.99,15.24 90 bottom
J122  51.28,15.24 90 bottom
L101  29.69,49.21 270 bottom
L102  34.61,49.21 270 bottom
Q101  44.61,31.91 90 top
Q102  21.11,10.64 90 top
Q103  25.72,10.16 90 bottom
Q104  32.07,10.16 90 bottom
Q105  71.6,40.64 90 top
Q106  68.74,32.07 90 top
Q151  48.58,30.32 0 bottom
Q153  62.07,35.88 90 top
Q180  54.93,20.32 270 bottom
Q181  82.87,57.15 0 top
Q182  84.93,43.97 180 top
Q183  84.77,33.5 0 top
Q184  77.79,60.33 180 bottom
Q190  7.14,58.58 90 top
R101  18.26,27.78 270 bottom
R102  18.26,34.13 270 bottom
R103  10.16,21.43 90 top
R104  10.64,38.89 270 top
R105  12.54,21.43 90 top
R106  13.02,38.89 90 top
R107  7.78,21.43 90 top
R108  8.25,38.89 90 top
R109  9.53,23.34 270 bottom
R110  9.53,28.89 270 bottom
R111  30.96,42.55 90 bottom
R112  33.34,42.55 90 bottom
R113  28.58,42.55 90 bottom
R114  35.72,42.55 90 bottom
R115  24.13,57.15 270 top
R116  21.75,57.15 270 top
R120  11.59,36.51 270 bottom
R121  26.99,9.68 90 top
R122  26.99,6.19 90 top
R125  62.71,30.32 270 top
R127  14.92,21.43 270 top
R128  15.4,38.89 270 top
R129  73.82,36.2 270 top
R130  71.28,36.2 90 top
R131  72.87,27.78 90 top
R132  68.74,36.2 90 top
R133  70.33,27.78 90 top
R134  65.56,27.78 270 top
R135  61.91,25.4 180 bottom
R136  60.01,30.32 270 top
R137  65.25,49.85 90 top
R138  61.12,49.85 90 top
R139  56.99,49.85 90 top
R140  52.86,49.85 90 top
R141  48.74,49.85 90 top
R142  46.67,49.85 90 top
R143  42.55,49.85 90 top
R144  38.42,49.85 90 top
R145  34.29,49.85 90 top
R146  14.29,36.51 90 bottom
R151  53.98,20.8 180 top
R155  39.37,21.75 90 bottom
R156  39.37,17.94 90 bottom
R158  38.89,46.51 270 bottom
R159  41.43,42.23 90 bottom
R160  44.13,46.51 270 bottom
R161  46.83,42.23 90 bottom
R162  49.53,46.51 270 bottom
R163  52.07,42.23 90 bottom
R164  54.77,46.51 270 bottom
R165  57.31,42.23 90 bottom
R166  60.01,46.51 270 bottom
R167  45.09,19.21 180 bottom
R171  14.29,28.89 270 bottom
R172  14.29,32.7 90 bottom
R180  58.42,20.32 90 bottom
R181  58.42,16.51 90 bottom
R182  56.04,16.51 90 bottom
R183  58.26,10 180 bottom
R184  54.45,10 180 bottom
R185  58.26,15.08 0 top
R186  54.29,15.08 0 top
R187  8.73,63.5 180 top
R192  5.87,35.4 90 bottom
R193  7.14,50.32 0 top
R194  7.14,47.94 180 top
R195  10.32,46.04 90 top
R196  7.14,55.09 0 top
R197  12.7,46.99 180 bottom
R198  12.7,49.69 0 bottom
R199  48.74,17.94 180 top
U185  85.09,9.21 0 top

### Tracks (layer width: path | path; a pad name or v marks a point on that pad's centre or on a via)
+5V_READ  (13 unrouted)
+5V_WRITE  (via drill 0.33)  (15 unrouted)
  Top 0.203: Q181.13 82.23,58.74 81.49,58 C181.1
  Top 0.305: C183.1 80.33,36.57 Q183.14 Q183.13 | C181.1 v75.72,59.53 76.42,60.22 Q181.16
  Bottom 0.203: Q184.16 73.34,59.53 | 73.34,59.53 73.34,61.6 | 73.34,61.6 Q184.1 | Q184.7 80.96,61.6 | 80.96,61.6 Q184.10 | Q184.6 79.69,61.6 | 79.69,61.6 75.88,61.6 | 75.88,61.6 73.34,61.6 | Q184.3 75.88,61.6 | 79.69,61.6 80.96,61.6 | 73.34,59.53 v75.72,59.53
  Bottom 0.305: C152.2 51.22,32.92 50.48,33.66 Q151.19
+8V  (6 unrouted)
ANA_L  (2 unrouted)
ANA_R  (2 unrouted)
BIAS1  (2 unrouted)
CC/!DCC  (1 unrouted)
GND  (77 unrouted)
IN_L  (1 unrouted)
IN_R  (1 unrouted)
INMF_L  (4 unrouted)
INMF_R  (4 unrouted)
IRH0
  Bottom 0.203: Q151.24 57.89,35.35 58.9,36.35 58.9,37.94 61.28,40.32 61.28,42.55 63.34,44.61 63.34,46.99 62.97,47.36 C165.2 62.07,53.98 60.95,55.1 J101.29
IRH1
  Bottom 0.203: Q151.23 55.56,36.67 59.37,40.48 C164.2 60.27,41.38 60.64,41.75 60.64,43.97 60.32,44.29 59.21,44.29 58.74,44.77 58.74,46.99 59.11,47.36 R166.1 60.01,54.13 58.95,55.19 J101.27
IRH2
  Bottom 0.203: Q151.22 54.29,36.67 57.31,39.69 R165.1 56.41,41.38 56.04,41.75 56.04,43.97 56.36,44.29 57.63,44.29 58.1,44.77 58.1,46.99 57.73,47.36 C163.2 56.83,54.77 56.99,54.93 56.99,57.91 J101.25
IRH3
  Bottom 0.203: Q151.21 53.02,36.67 54.13,37.78 C162.2 55.03,41.38 55.4,41.75 55.4,43.97 55.09,44.29 53.97,44.29 53.5,44.77 53.5,46.99 53.87,47.36 R164.1 54.77,54.93 54.95,55.11 J101.23
IRH4
  Bottom 0.203: Q151.20 51.75,36.99 52.07,37.31 R163.1 51.17,41.38 50.8,41.75 50.8,43.97 51.12,44.29 52.39,44.29 52.86,44.77 52.86,46.99 52.49,47.36 C161.2 51.59,52.39 52.95,53.74 J101.21
IRH5
  Bottom 0.203: Q151.18 49.21,36.99 48.89,37.31 C160.2 49.79,41.38 50.16,41.75 50.16,43.97 49.85,44.29 48.74,44.29 48.26,44.77 48.26,47.15 48.47,47.36 R162.1 49.53,52.39 50.95,53.81 J101.19
IRH6
  Bottom 0.203: Q151.17 47.94,36.67 46.83,37.78 R161.1 45.93,41.38 45.56,41.75 45.56,43.81 46.04,44.29 46.99,44.29 47.47,44.77 47.47,46.99 47.09,47.36 C159.2 46.2,51.75 48.95,54.51 J101.17
IRH7
  Bottom 0.203: Q151.16 46.67,36.67 43.5,39.85 C158.2 44.39,41.38 44.77,41.75 44.77,43.81 44.29,44.29 43.34,44.29 42.86,44.77 42.86,47.15 43.08,47.36 R160.1 44.13,51.75 46.95,54.57 J101.15
IRH8
  Bottom 0.203: Q151.15 45.4,36.67 41.43,40.64 R159.1 40.54,41.38 40.16,41.75 40.16,43.97 40.48,44.29 41.91,44.29 42.23,44.61 42.23,47.15 42.01,47.36 C157.2 40.96,51.44 44.95,55.43 J101.13
IRH9
  Bottom 0.203: Q151.14 44.13,36.51 37.62,43.02 37.62,47.15 37.84,47.36 R158.1 38.89,51.44 42.95,55.49 J101.11
MFL_1  (3 unrouted)
MFL_2  (1 unrouted)
MFL_3  (1 unrouted)
MFL_A  (1 unrouted)
  Bottom 0.203: R113.2 28.57,44.29 26.99,45.88 26.99,48.42 27.78,49.21 31.43,49.21 32.07,49.85 32.07,51.91 36.95,56.79 J101.5
MFL_B  (1 unrouted)
  Bottom 0.203: L101.1 29.69,52.39 33.95,56.49 J101.2
MFR_1  (1 unrouted)
MFR_2  (1 unrouted)
MFR_A  (1 unrouted)
  Bottom 0.203: R114.2 35.72,44.77 36.83,45.88 36.83,48.9 37.31,49.37 37.31,53.82 39.95,56.46 J101.8
MFR_B  (1 unrouted)
  Bottom 0.203: L102.1 34.61,52.7 37.95,56.05 J101.6
MRH_L  (3 unrouted)
MRH_R  (3 unrouted)
N$1
  Top 0.203: Q101.20 41.61,41.89 37.46,46.04 34.13,46.04 32.23,47.94 C111.2
N$2
  Top 0.203: Q101.19 42.61,42.32 36.35,48.58 C110.2
N$3
  Top 0.203: Q101.18 43.61,44.5 40.48,47.62 C109.2
N$4
  Top 0.203: Q101.17 C108.2
N$5
  Top 0.203: Q101.15 46.61,43.59 50.8,47.78 C107.2
N$6
  Top 0.203: Q101.14 47.61,43.16 51.28,46.83 53.66,46.83 54.93,48.1 C106.2
N$7
  Top 0.203: Q101.13 48.61,42.73 51.75,45.88 56.83,45.88 59.05,48.1 C105.2
N$8
  Top 0.203: Q101.12 49.61,42.15 52.39,44.93 60.17,44.93 63.18,47.94 C104.2
N$9
  Top 0.203: Q101.11 53.11,42.31 54.77,43.97 63.34,43.97 67.97,48.6 C103.-
N$10  (via drill 3.2)
  other vias: 9.68,10.95
N$11  (2 unrouted)
N$12  (2 unrouted)
N$13  (4 unrouted)
N$14  (1 unrouted)
N$15  (1 unrouted)
N$16  (1 unrouted)
N$17  (1 unrouted)
N$18  (2 unrouted)
N$19  (via drill 0.33)
  Top 0.203: C111.1 32.23,50.8 | 32.23,50.8 C130.1 | 32.23,50.8 32.33,50.7 R145.2 34.29,55.4 38.89,60.01 v41.95,60.01
  Bottom 0.203: v41.95,60.01 J101.10
N$20  (via drill 0.33)
  Top 0.203: C129.1 C110.1 R144.2 38.42,54.45 v43.97,60.01
  Bottom 0.203: v43.97,60.01 43.97,57.98 J101.12
N$21  (via drill 0.33)
  Top 0.203: C128.1 C109.1 R143.2 42.54,56.6 v45.95,60.01
  Bottom 0.203: v45.95,60.01 J101.14
N$22  (via drill 0.33)
  Top 0.203: C127.1 C108.1 R142.2 46.67,58.74 v47.94,60.01
  Bottom 0.203: v47.94,60.01 v47.95,60 J101.16
N$23  (via drill 0.33)
  Top 0.203: C126.1 R141.2 C107.1 50.8,58.7 v51.95,59.85
  Bottom 0.203: v51.95,59.85 J101.20
N$24  (via drill 0.33)
  Top 0.203: C125.1 R140.2 C106.1 54.93,58.9 v53.97,59.85
  Bottom 0.203: v53.97,59.85 53.97,57.98 J101.22
N$25  (via drill 0.33)
  Top 0.203: C124.1 R139.2 C105.1 59.05,56.74 v55.95,59.85
  Bottom 0.203: v55.95,59.85 J101.24
N$26  (via drill 0.33)
  Top 0.203: C123.1 R138.2 C104.1 63.18,54.61 v57.94,59.85
  Bottom 0.203: v57.94,59.85 v57.95,59.84 J101.26
N$27  (via drill 0.33)
  Top 0.203: R137.2 C122.1 66.99,52.65 | 66.99,52.65 69.97,52.65 C103.+ | 66.99,52.65 66.99,55.24 62.39,59.85 v59.95,59.85
  Bottom 0.203: v59.95,59.85 J101.28
N$28  (2 unrouted)
N$29  (1 unrouted)
N$30
  Bottom 0.203: C165.1 R166.2
N$31
  Bottom 0.203: C164.1 R165.2
N$32
  Bottom 0.203: C163.1 R164.2
N$33
  Bottom 0.203: C162.1 R163.2
N$34
  Bottom 0.203: C161.1 R162.2
N$35
  Bottom 0.203: C160.1 R161.2
N$36
  Bottom 0.203: C159.1 R160.2
N$37
  Bottom 0.203: C158.1 R159.2
N$38
  Bottom 0.203: C157.1 R158.2
N$39  (2 unrouted)
N$40  (1 unrouted)
N$41  (1 unrouted)
N$42  (1 unrouted)
N$43  (1 unrouted)
N$44
  Top 0.203: Q101.9 57.93,34.91 58.9,35.88 Q153.C
N$45  (1 unrouted)
N$46
  Bottom 0.203: Q180.B 58.32,21.27 R180.2 59.32,21.17 59.85,20.64 59.85,18.79 R181.2
N$47
  Bottom 0.203: R182.2 56.04,19.36 Q180.E
N$48
  Bottom 0.203: R156.2 43.87,18.79 45.08,20 R167.S | R167.E R167.S | R167.S 45.08,22.54 44.13,23.5 Q151.11
N$49  (via drill 0.33)
  Bottom 0.203: R155.2 40.54,22.6 40.96,23.02 40.96,25.24 | 40.96,25.24 v40.96,26.03 | 40.96,25.24 41.01,25.29 Q151.12 42.86,23.34 43.73,22.46 R167.A
N$50  (1 unrouted)
N$51  (2 unrouted)
N$52  (4 unrouted)
N$53  (1 unrouted)
N$54
  Top 0.203: C141.2 60.51,26.91 Q101.1
N$55
  Top 0.203: Q101.7 55.93,32.91 56.67,33.66 58.9,33.66 60.01,32.54 R136.1
N$56
  Top 0.203: R136.2 R125.2 62.71,28.58 62.29,28.16 C141.1
N$57  (1 unrouted)
N$58  (1 unrouted)
N$59  (1 unrouted)
N$60  (3 unrouted)
N$61  (4 unrouted)
N$62  (3 unrouted)
N$63  (1 unrouted)
N$64  (1 unrouted)
N$65  (1 unrouted)
N$66
  Bottom 0.305: R112.2 33.34,44.45 34.61,45.72 L102.2
N$67
  Bottom 0.305: R111.2 30.96,44.61 29.69,45.88 L101.2
N$68  (1 unrouted)
N$69  (1 unrouted)
N$70  (2 unrouted)
N$71  (1 unrouted)
N$72  (1 unrouted)
N$73  (1 unrouted)
N$74  (1 unrouted)
N$75  (3 unrouted)
N$76  (1 unrouted)
N$77  (1 unrouted)
N$78  (2 unrouted)
N$79  (1 unrouted)
N$80  (1 unrouted)
N$81  (1 unrouted)
N$82  (1 unrouted)
N$83  (2 unrouted)
N$84  (2 unrouted)
N$85  (1 unrouted)
OUT_L  (1 unrouted)
OUT_R  (1 unrouted)
R184_END  (3 unrouted)
RD_CLCK  (2 unrouted)
RD_MUX  (1 unrouted)
RD_SYNC  (1 unrouted)
RDMUX  (1 unrouted)
REF_4  (1 unrouted)
SENSE_GND  (2 unrouted)
SOURCE
  Bottom 0.203: Q180.C 53.83,20.78 50.48,24.13 Q151.6
VSENSE_1  (11 unrouted)
  Top 0.203: R145.1 34.29,47.62 | 65.25,47.62 R137.1 | R138.1 61.12,47.62 | R139.1 56.99,47.62 | R140.1 52.86,47.62 | R141.1 48.74,47.62 | R142.1 46.67,47.62 | R143.1 42.54,47.62 | R144.1 38.42,47.62
VSENSE_2  (3 unrouted)
WCLCK  (3 unrouted)
WDATA  (3 unrouted)